# EAGLE design Tiny_Programmer (EAGLE 7.5.0)
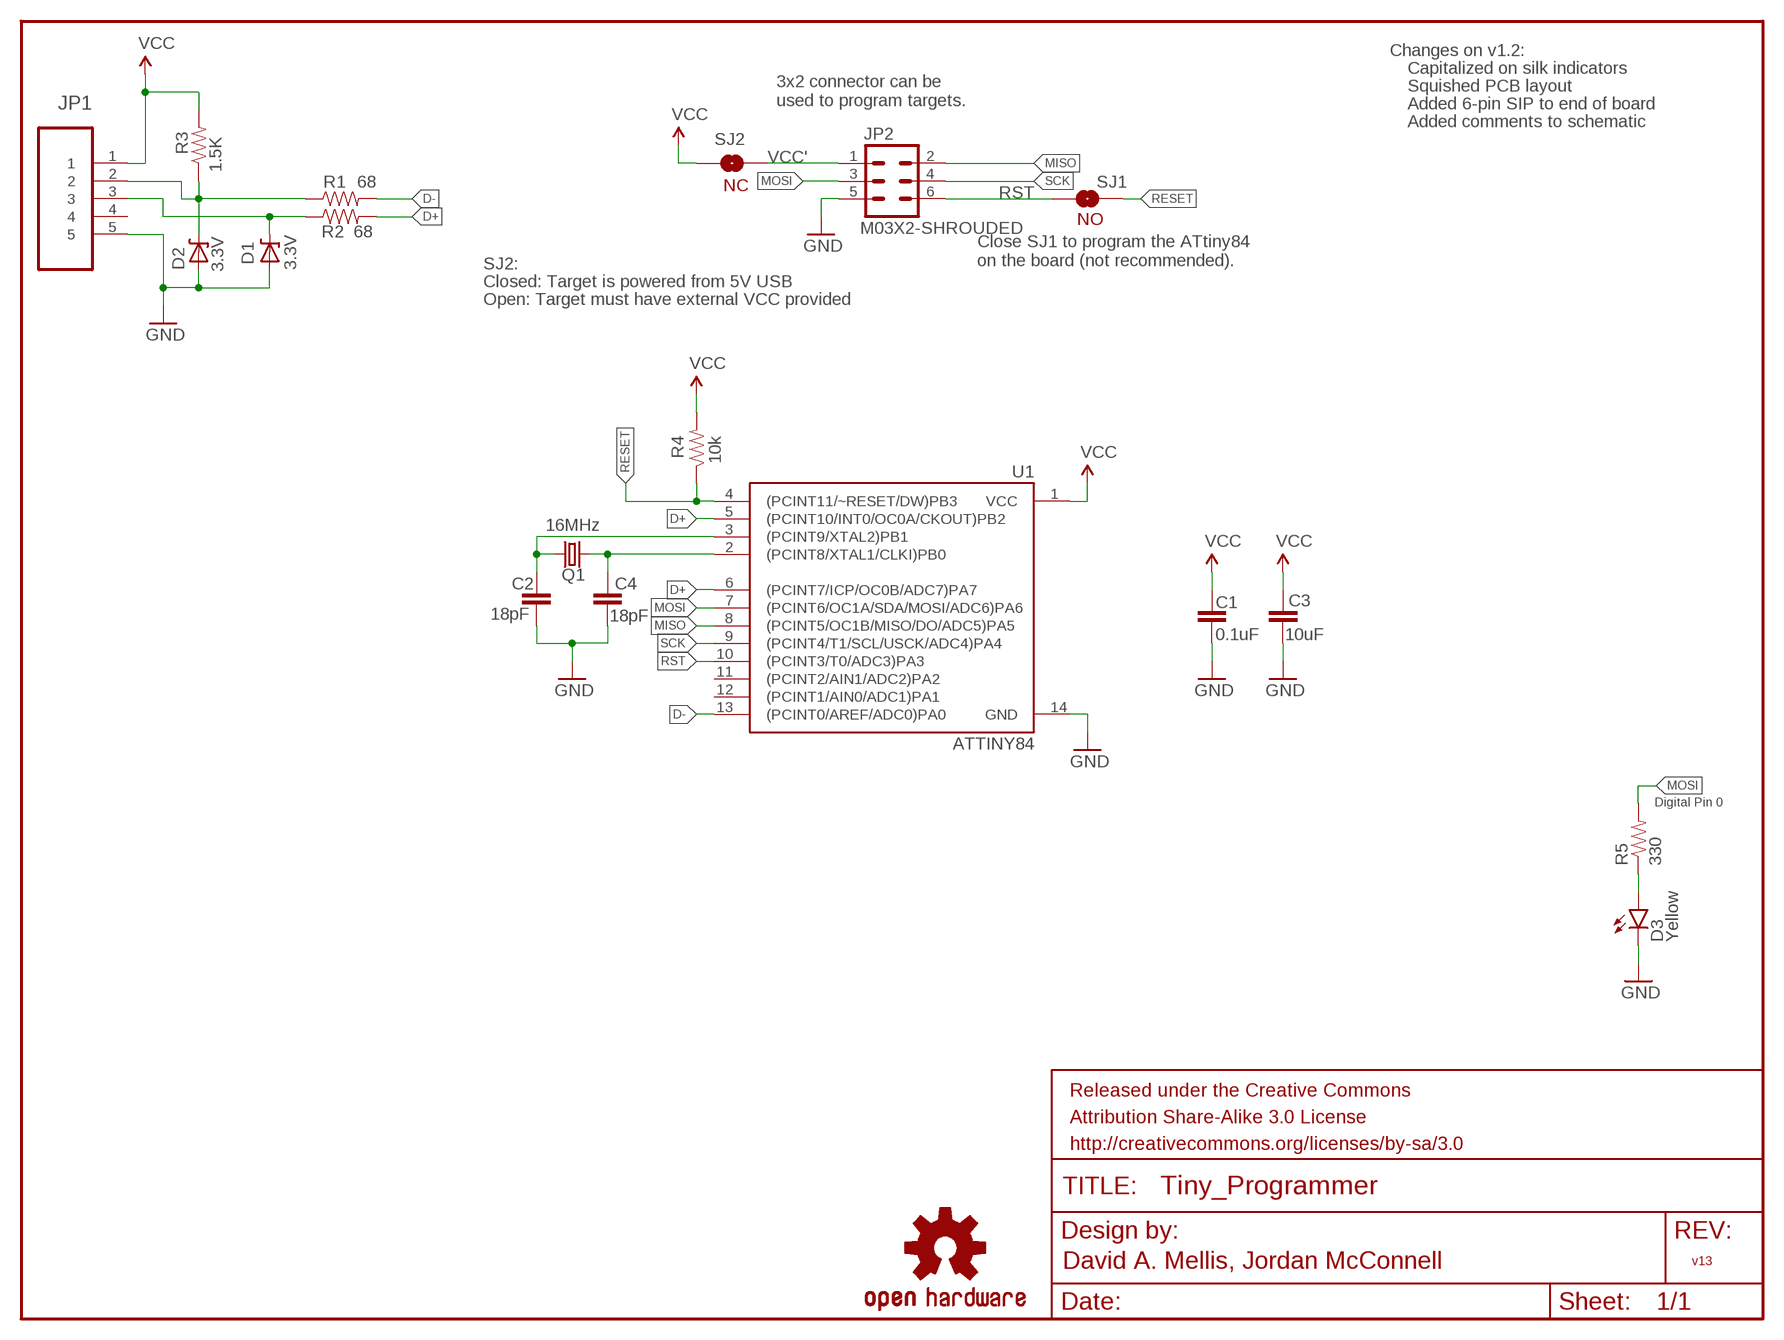
[diagram p0: schematic, sheet 1]

## Parts
C1  0.1uF  CAP0603-CAP  [0603-CAP]
C2  18pF  CAP0603-CAP  [0603-CAP]
C3  10uF  CAP0603-CAP  [0603-CAP]
C4  18pF  CAP0603-CAP  [0603-CAP]
D1  3.3V  DIODE-ZENER-BZT52  [SOD-323]
D2  3.3V  DIODE-ZENER-BZT52  [SOD-323]
D3  Yellow  LED0603  [LED-0603]
FRAME1  FRAME-LETTER  [CREATIVE_COMMONS]
JP1  47346-0001  [MOLEX_47346-0001]
JP2  M03X2-SHROUDED  [2X3-SHROUDED-B]
Q1  16MHz  CRYSTAL5X3  [CRYSTAL-SMD-5X3]
R1  68  RESISTOR0603  [0603-RES]
R2  68  RESISTOR0603  [0603-RES]
R3  1.5K  RESISTOR0603  [0603-RES]
R4  10k  RESISTOR0603  [0603-RES]
R5  330  RESISTOR0603  [0603-RES]
SJ1  SOLDERJUMPERNO  [SJ_2S-NO]
SJ2  NC  SOLDERJUMPERNC  [SJ_2S]
U1  ATTINY84  [SO14]
U$1  OSHW-LOGOS  [OSHW-LOGO-S]

## Nets
D+: R2.2 U1.5((PCINT10/INT0/OC0A/CKOUT)PB2) U1.6((PCINT7/ICP/OC0B/ADC7)PA7)
D-: R1.2 U1.13((PCINT0/AREF/ADC0)PA0)
GND: C1.2 C2.2 C3.2 C4.2 D1.2(A) D2.2(A) D3.C JP1.5 JP2.5 U1.14(GND)
MISO: JP2.2 U1.8((PCINT5/OC1B/MISO/DO/ADC5)PA5)
MOSI: JP2.3 R5.2 U1.7((PCINT6/OC1A/SDA/MOSI/ADC6)PA6)
N$3: C2.1 Q1.3 U1.3((PCINT9/XTAL2)PB1)
N$4: C4.1 Q1.1 U1.2((PCINT8/XTAL1/CLKI)PB0)
N$5: D3.A R5.1
RESET: R4.1 SJ1.1 U1.4((PCINT11/~RESET/DW)PB3)
RST: JP2.6 SJ1.2 U1.10((PCINT3/T0/ADC3)PA3)
SCK: JP2.4 U1.9((PCINT4/T1/SCL/USCK/ADC4)PA4)
USBDM: D2.1(C) JP1.2 R1.1 R3.1
USBSP: D1.1(C) JP1.3 R2.1
VCC: C1.1 C3.1 JP1.1 R3.2 R4.2 SJ2.1 U1.1(VCC)
VCC': JP2.1 SJ2.2
Unconnected: JP1.4 U1.11((PCINT2/AIN1/ADC2)PA2) U1.12((PCINT1/AIN0/ADC1)PA1)

## Notes on the sheet
- Changes on v1.2:
- Capitalized on silk indicators
- Squished PCB layout
- 3x2 connector can be
  used to program targets.
- Added 6-pin SIP to end of board
- Added comments to schematic
- NC
- NO
- Close SJ1 to program the ATtiny84
  on the board (not recommended).
- SJ2:
- Closed: Target is powered from 5V USB
- Open: Target must have external VCC provided
- Digital Pin 0
- v13
- David A. Mellis, Jordan McConnell

## Library data of the parts
C1-C4 = SparkFun-Capacitors:CAP: Capacitor Standard 0603 ceramic capacitor, and 0.1" leaded capacitor.
D1 D2 = SparkFun-DiscreteSemi:DIODE-ZENER: Zener Diode Production Part - 8199 3.4V Zener Voltage
D3 = SparkFun-LED:LED: LEDs Standard schematic elements and footprints for 5mm, 3mm, 1206, and 0603 sized LEDs. 5mm - Spark Fun Electronics SKU : COM-00529 (and others)
FRAME1 = SparkFun-Aesthetics:FRAME-LETTER: Schematic Frame Standard 8.5x11 US Letter frame
JP1 = Molex-47346-0001:47346-0001: CONN RCPT 5POS MICRO USB R/A SMD; MPN: 47346-0001; OC_FARNELL: 1568026; OC_NEWARK: 47M0505; PACKAGE: 5 POS MICRO USB R/A; SUPPLIER: MOLEX
JP2 = Darryl:M03X2
Q1 = SparkFun-FreqCtrl:CRYSTAL: Various standard crystals. Proven footprints.; PROD_ID: XTAL-08218
R1-R5 = SparkFun-Resistors:RESISTOR: Resistor Basic schematic elements and footprints for 0603, 1206, and PTH resistors.
SJ1 SJ2 = SparkFun-Passives:SOLDERJUMPER: Solder Jumper Standard SMD solder jumper. Used to automate production. Two varients : Normally Open and Normally Closed are the same, but have different paste layers. NC will have a large amount of paste and should jumper during reflow.
U1 = SparkFun-DigitalIC:ATTINY84: Atmel 14-pin 2/4/8kB flash uC
U$1 = SparkFun-Aesthetics:OSHW-LOGO: Open Source Hardware Logo This logo indicates the piece of hardware it is found on incorporates a OSHW license and/or adheres to the definition of open source hardware found here: http://freedomdefined.org/OSHW

## Board
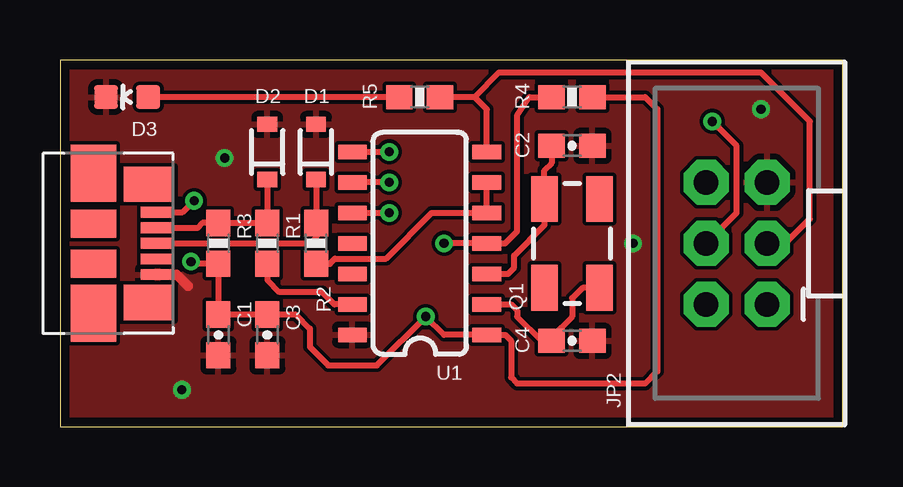
[diagram p1: board, top side]
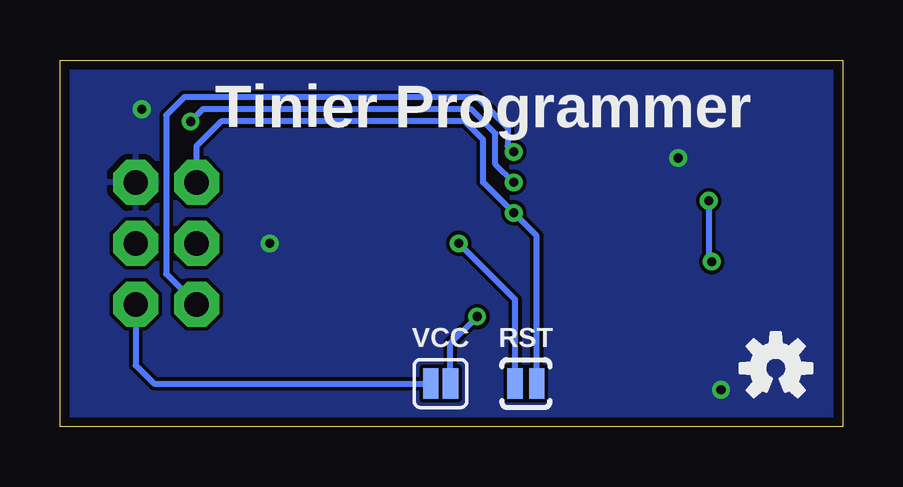
[diagram p2: board, bottom side, seen from below]

Size 32.62 x 15.28 mm. Coordinates in mm from the lower left corner, seen from the top.
Outline: 0,15.28 0,0 32.62,0 32.62,15.28 0,15.28
Copper layers (1*16): Top 0.0356mm / dielectric 1.5011mm / Bottom 0.0356mm
Design rules "oshpark-2layer *": minimum track width 6mil, minimum drill 13mil, track to track 6mil, track to pad 6mil, pad to pad 6mil, via to via 6mil, smd to smd 6mil, copper to edge 15mil, drill to drill 6mil, minimum pad ring 7mil, minimum via ring 7mil, stop-mask expansion 4mil, vias tented up to drill 20mil, thermal gap 10mil

### Footprints (pad centres in the part's own frame; a part is rotated, then mirrored left to right if it is on the bottom)
0603-CAP = smd 1.1 x 1: 1 -0.85,0; 2 0.85,0
SOD-323 = smd 0.63 x 0.83: 1 -1.15,0; 2 1.15,0
LED-0603 = smd 1 x 1: A 0,-0.877; C 0,0.877
MOLEX_47346-0001 = smd 0.45 x 1.38: 1 -1.3,0; 2 -0.65,0; 3 0,0; 4 0.65,0; 5 1.3,0 | smd 1.475 x 2.1: M1 -2.462,-0.36; M2 2.462,-0.36 | smd 2.375 x 1.9: M3 -2.913,-2.66; M6 2.913,-2.66 | smd 1.175 x 1.9: M4 -0.82,-2.66; M5 0.85,-2.66
2X3-SHROUDED-B = drill 1.016 pad 1.88 octagon: 1 -2.54,-1.27; 2 -2.54,1.27; 3 0,-1.27; 4 0,1.27; 5 2.54,-1.27; 6 2.54,1.27
CRYSTAL-SMD-5X3 = smd 1.9 x 1.1: 1 -1.85,-1.15; 2 1.85,-1.15; 3 1.85,1.15; 4 -1.85,1.15
0603-RES = smd 1.1 x 1: 1 -0.85,0; 2 0.85,0
SJ_2S-NO = smd 0.635 x 1.27: 1 -0.45,0; 2 0.45,0
SJ_2S = smd 0.635 x 1.27: 1 -0.412,0; 2 0.412,0
SO14 = smd 0.6 x 1.2: 1 -3.81,-2.8; 2 -2.54,-2.8; 3 -1.27,-2.8; 4 0,-2.8; 5 1.27,-2.8; 6 2.54,-2.8; 7 3.81,-2.8; 8 3.81,2.8; 9 2.54,2.8; 10 1.27,2.8; 11 0,2.8; 12 -1.27,2.8; 13 -2.54,2.8; 14 -3.81,2.8

### Placement (x,y rotation side)
C1  6.6,3.83 270 top
C2  21.34,11.7 0 top
C3  8.64,3.83 270 top
C4  21.34,3.58 0 top
D1  10.67,11.45 90 top
D2  8.64,11.45 90 top
D3  2.79,13.74 90 top
FRAME1  -1.02,-52.05 0 top  (outside the outline)
JP1  4.06,7.64 270 top
JP2  28.19,7.64 90 top
Q1  21.34,7.64 90 top
R1  8.64,7.64 270 top
R2  10.67,7.64 270 top
R3  6.6,7.64 270 top
R4  21.34,13.74 0 top
R5  14.99,13.74 0 top
SJ1  13.21,1.8 0 bottom
SJ2  16.76,1.8 180 bottom
U1  14.99,7.64 90 top
U$1  2.79,2.43 0 bottom

### Tracks (layer width: path | path; a pad name or v marks a point on that pad's centre or on a via)
D+
  Top 0.254: U1.6 U1.5 15.49,8.91 13.59,7 11.46,7 11.24,6.79 R2.2
D-
  Top 0.254: R1.2 8.64,6.12 9.14,5.61 10.92,5.61 11.43,5.1 U1.13
GND  (via drill 0.38)
  Top 0.406: JP1.5 4.86,6.34 5.33,5.86
  other vias: 29.21,13.23 23.88,7.64 6.86,11.2 5.08,1.54
  pour Top: -1.52,16.28 35.31,16.28 35.31,-1.76 -1.52,-1.76
  pour Bottom: -1.02,15.77 34.54,15.77 34.54,-1.76 -4.32,-1.76 -4.32,15.26
MISO  (via drill 0.38)
  Top 0.254: U1.8 v13.72,11.45
  Bottom 0.254: v13.72,11.45 13.97,11.7 13.97,12.47 15.24,13.74 27.43,13.74 28.19,12.97 28.19,6.37 JP2.2
MOSI
  Top 0.254: U1.7 17.79,13.22 17.27,13.74 | 17.27,13.74 R5.2 | JP2.3 30.23,7.64 31.24,8.66 31.24,12.72 29.21,14.75 18.29,14.75 17.27,13.74
N$3
  Top 0.254: U1.3 18.67,6.37 18.92,6.62 18.92,7.13 20.19,8.4 Q1.3 20.19,10.68 20.49,10.98 C2.1
N$4
  Top 0.254: U1.2 18.8,5.1 19.05,4.85 19.05,4.59 20.07,3.58 C4.1 20.49,3.74 21.34,4.59 21.34,5.35 21.77,5.79 Q1.1
N$5
  Top 0.254: R5.1 D3.A
RESET  (via drill 0.38)
  Top 0.254: v16,7.64 U1.4 18.54,7.64 19.05,8.15 19.05,12.97 19.56,13.74 R4.1
  Bottom 0.254: SJ1.1 13.66,5.3 v16,7.64
RST  (via drill 0.38)
  Top 0.254: U1.10 v13.72,8.91
  Bottom 0.254: SJ1.2 12.76,7.95 v13.72,8.91 14.99,10.18 14.99,11.96 15.75,12.72 25.91,12.72 26.92,11.7 JP2.6
SCK  (via drill 0.38)
  Top 0.254: v13.72,10.18 U1.9 | JP2.4 28.19,8.91 28.19,11.7 v27.18,12.72
  Bottom 0.254: v13.72,10.18 14.48,10.94 14.48,12.21 15.49,13.23 26.67,13.23 v27.18,12.72
USBDM
  Top 0.254: JP1.2 5.73,8.29 5.93,8.49 R3.1 R1.1 D2.1
USBSP
  Top 0.254: D1.1 R2.1 10.67,7.89 10.41,7.64 JP1.3
VCC  (via drill 0.38)
  Top 0.254: U1.1 18.03,3.83 | JP1.1 5.11,8.94 v5.59,9.42 | v5.46,6.88 5.55,6.79 R3.2 C1.1 C3.1 9.82,4.68 10.41,4.08 10.41,3.32 11.18,2.56 13.21,2.56 v15.24,4.59 16,3.83 U1.1 | R4.2 24.38,13.74 24.89,13.23 24.89,2.31 24.38,1.8 19.05,1.8 18.8,2.05 18.8,3.58 18.54,3.83 U1.1
  Bottom 0.254: v5.59,9.42 5.59,7 v5.46,6.88 | SJ2.1 16.35,3.48 v15.24,4.59
VCC'
  Bottom 0.254: JP2.1 29.46,2.56 28.7,1.8 SJ2.2

### Text on the board
bPlace: Tinier Programmer | RST | VCC
tNames: MIT Media Lab | High-Low Tech | hlt.media.mit.edu
tValues: David A. Mellis, Jordan McConnell